# EAGLE design LB_w1_Wire_North-v03(rev2) (EAGLE 6.6.0)
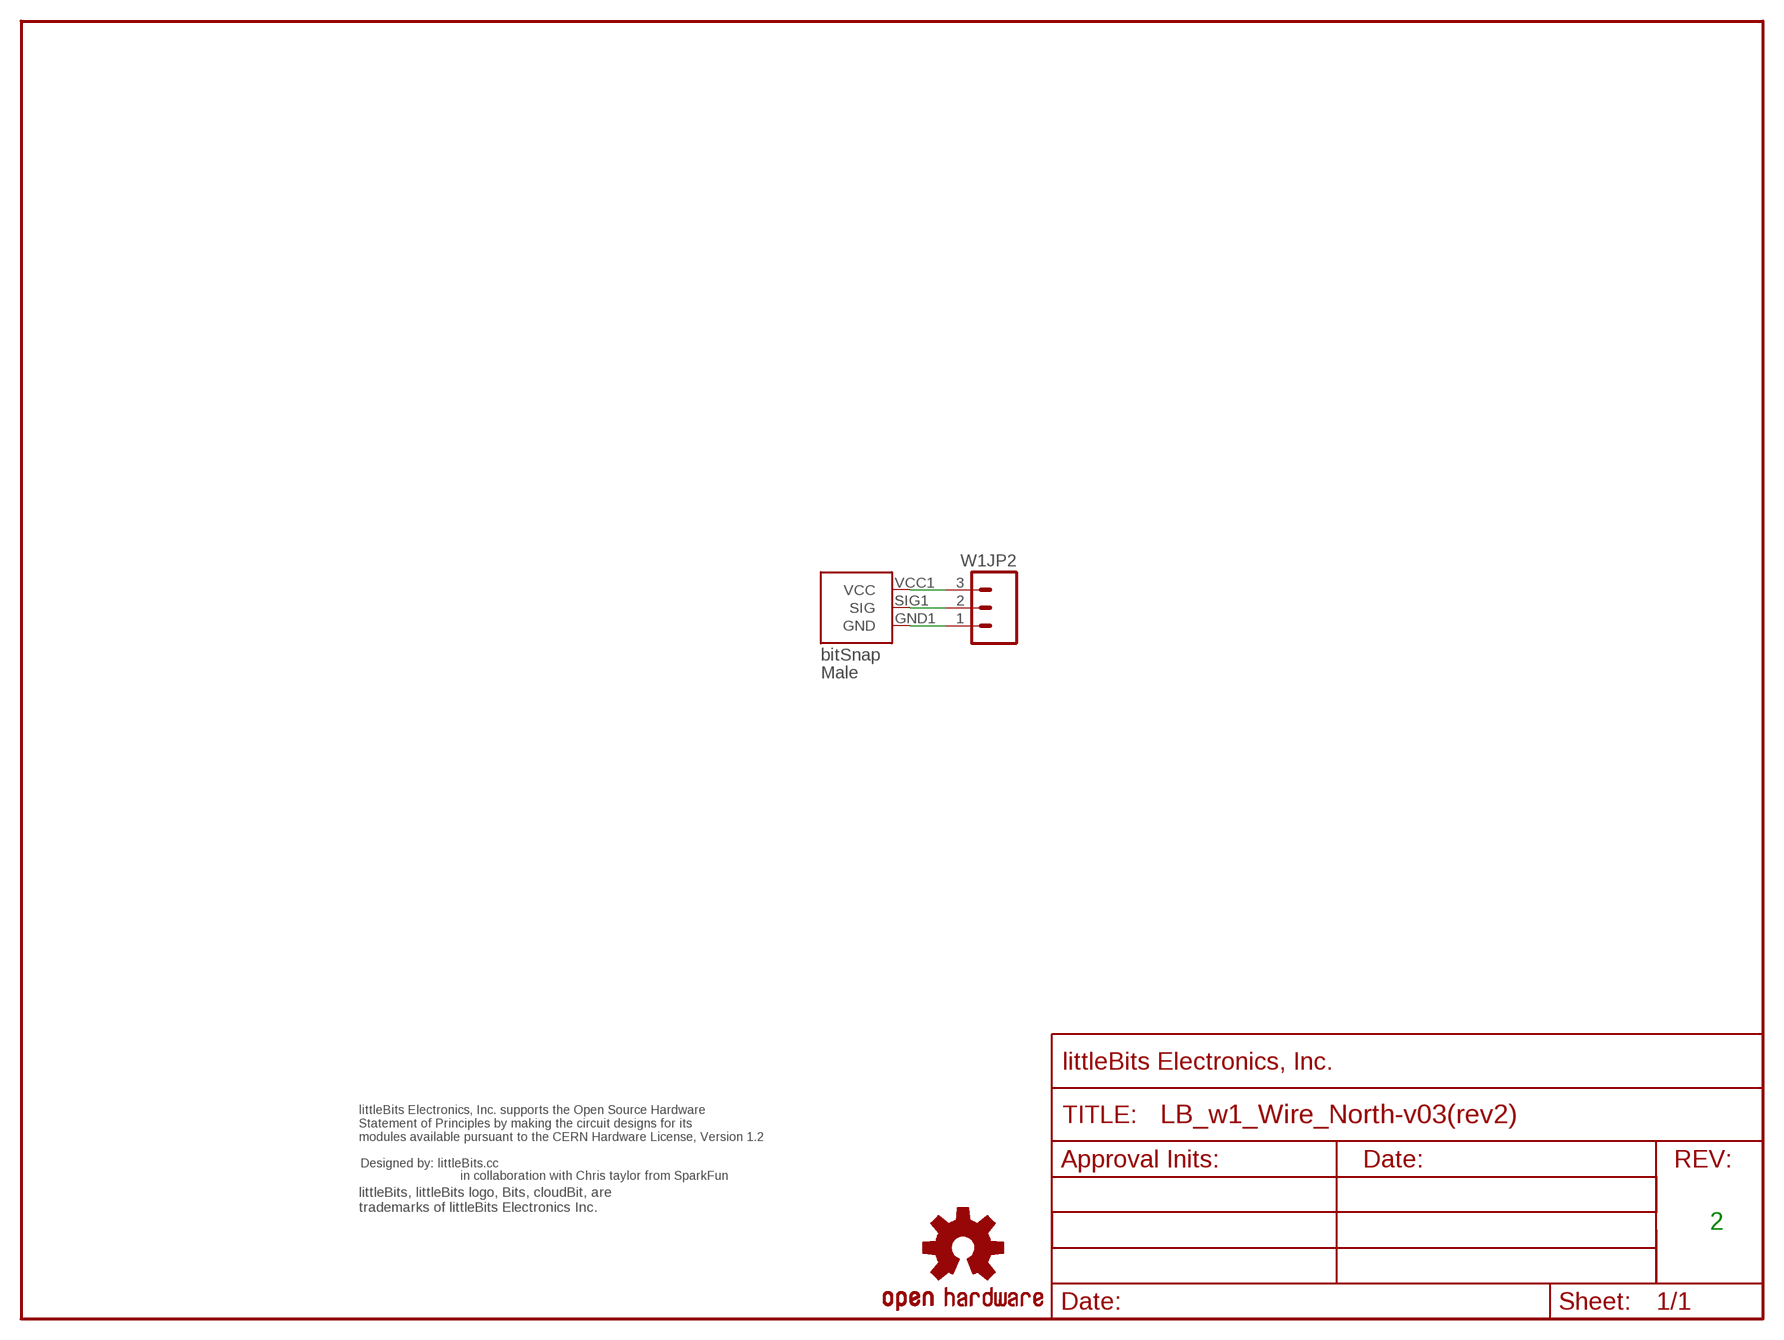
[diagram p0: schematic, sheet 1]

## Parts
FRAME1  FRAME-LETTER-OHWOHW  [FABDWG01-OHW]
U$1  OSHWCREDIT  [OSHWCREDIT]
U$3  OSHW-LOGOL  [OSHW-LOGO-L]
W1BSM1  BITSNAP_V03_MALE  [BITSNAP_V03_MALE]
W1JP2  M03SMD  [1X03-1MM-RA]

## Nets
GND: W1BSM1.GND1(GND) W1JP2.1
SIG: W1BSM1.SIG1(SIG) W1JP2.2
VCC: W1BSM1.VCC1(VCC) W1JP2.3

## Notes on the sheet
- in collaboration with Chris taylor from SparkFun
- 2

## Library data of the parts
FRAME1 = LITTLEBITS:FRAME-LETTER-OHW
U$1 = LITTLEBITS:OSHWCREDIT
U$3 = SparkFun:OSHW-LOGO: Open Source Hardware Logo This logo indicates the piece of hardware it is found on incorporates a OSHW license and/or adheres to the definition of open source hardware found here: http://freedomdefined.org/OSHW
W1BSM1 = bitSnap:BITSNAP_V03_MALE
W1JP2 = SparkFun:M03: Header 3 Standard 3-pin 0.1" header. Use with straight break away headers (SKU : PRT-00116), right angle break away headers (PRT-00553), swiss pins (PRT-00743), machine pins (PRT-00117), and female headers (PRT-00115). Molex polarized connector foot print use with SKU : PRT-08232 with associated crimp pins and housings.

## Board
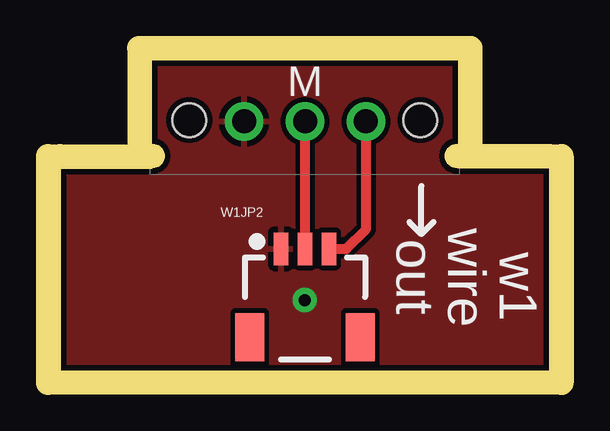
[diagram p1: board, top side]
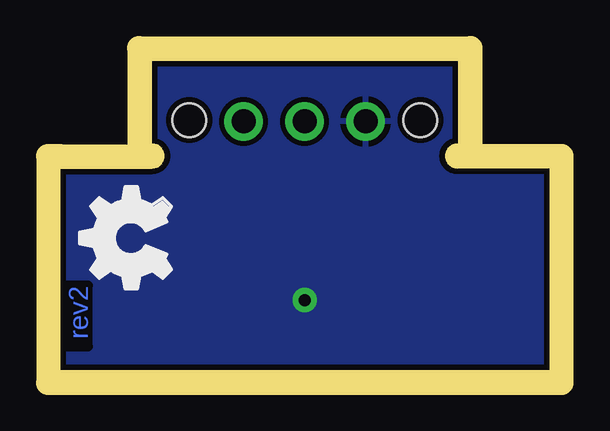
[diagram p2: board, bottom side, seen from below]

Size 20.4 x 12.95 mm. Coordinates in mm from the lower left corner, seen from the top.
Outline: 0,8.45 0,0 20.4,0 20.4,8.45
Copper layers (1*16): Top 0.035mm / dielectric 1.5mm / Bottom 0.035mm
Design rules "default": minimum track width 8mil, minimum drill 20mil, track to track 8mil, track to pad 8mil, pad to pad 8mil, via to via 8mil, smd to smd 8mil, copper to edge 10mil, drill to drill 8mil, minimum pad ring 12mil, minimum via ring 10mil, stop-mask expansion 4mil, vias tented up to drill 25mil, thermal gap 10mil
Milling: 5 lines

### Footprints (pad centres in the part's own frame; a part is rotated, then mirrored left to right if it is on the bottom)
BITSNAP_V03_MALE = drill 1: GND1 8.98,2.56; SIG1 6.44,2.56; VCC1 3.9,2.56 | hole 1.4: 11.27,2.5; 1.63,2.5
1X03-1MM-RA = smd 0.6 x 1.35: 1 -1,0; 2 0,0; 3 1,0 | smd 1.2 x 2: NC1 2.3,-3.675; NC2 -2.3,-3.675

### Placement (x,y rotation side)
FRAME1  -0.01,0 0 top
U$1  -23.9,-23.25 0 top  (outside the outline)
U$3  -30.8,-19.34 0 top  (outside the outline)
U$4  [OSHW_FILLX150_NOTEXT]  15.76,2.58 0 top
W1BSM1  16.65,12.95 180 top
W1JP2  10.21,5.08 0 top

### Tracks (layer width: path | path; a pad name or v marks a point on that pad's centre or on a via)
GND  (via drill 0.5)
  other vias: 10.2,2.95
  pour Top: 0.15,0.15 0.15,12.84 20.27,12.84 20.27,0.15
  pour Bottom: 0.15,0.15 0.15,12.8 20.25,12.8 20.25,0.15
SIG
  Top 0.406: W1JP2.2 W1BSM1.SIG1
VCC
  Top 0.406: W1JP2.3 11.93,5.08 12.75,5.9 W1BSM1.VCC1

### Text on the board
Bottom: rev2
tPlace: out | wire | w1
Milling: 1mm DIA. ROUTER PATH
dxf: in collaboration with Chris Taylor from SparkFun